# Altium schematic sheet Input Digital.SchDoc
size A3; SheetNumber: 6; SheetTotal: 8
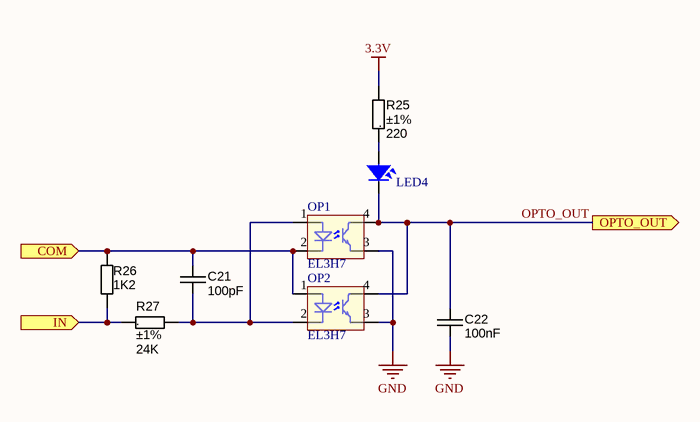
[diagram p0: Input Digital.SchDoc]

## Parts
C21  100pF  [CAPC1608X90N]
C22  100nF  [CAPC1608X90N]
LED4  LED  [LED-0805-Green]  (value not drawn)
OP1  EL3H7  [IC_SMD_SSOP4_NEW]
OP2  EL3H7  [IC_SMD_SSOP4_NEW]
R25  value 220  Tolerance: ±1%  [RESC1608X55N]  (hidden comment: 10K_0603_1%)
R26  value 1K2  [RES_2W_AXIAL_11x4_STAND]  (hidden comment: Metal Film)
R27  value 24K  Tolerance: ±1%  [RESC2012X70N]  (hidden comment: 24K_0805_1%)

## Ports
COM (in), IN (in), OPTO_OUT (out)

## Nets
3.3V: R25.2
GND: C22.2 OP1.3(E) OP2.3(E)
COM: C21.1 OP1.2(K) OP2.1(A) R26.1 ; port COM
IN: R26.2 R27.1 ; port IN
OPTO_OUT: C22.1 LED4.2 OP1.4(C) OP2.4(C) ; port OPTO_OUT
NetC21_2: C21.2 OP1.1(A) OP2.2(K) R27.2
NetLED4_1: LED4.1 R25.1

## Notes on the sheet
- Title
- Size:
- Date:
- A3
- Number:
- Time:
- Revision:
- Sheet
- of
- NICHIETSUVN.COM <http://NICHIETSUVN.COM>
- R&D
- File:
- (in symbol RES_10K_0603_1%) .
- (in symbol RES_24K_0805_1%) .

## Library data of the parts
C21 = CAPC_100pF_0603_C0G_NP0_100V_5%: 100pF ±5% 100V Ceramic Capacitor C0G, NP0 0603 (1608 Metric); Manufacturer 1: TDK Corporation; Pcs 2: 10; Tolerance: ±5%; Operating Temperature: -55°C ~ 125°C; Package / Case: 0603 (1608 Metric); Voltage - Rated: 100V; Temperature Coefficient: C0G, NP0; Ratings: AEC-Q200; Applications: Automotive; Packaging: Digi-Reel®; Supplier 1: Digi-Key; Supplier Part Number 1: 445-5724-6-ND; Value: 100pF; Supplier 2: https://www.thegioiic.com; Supplier Part Number 2: https://www.thegioiic.com/products/tu-gom-0603-100pf-50v; Price 2: 1800
C22 = CAPC_100nF_0603_X7R_50V_10%: 0.1µF ±10% 50V Ceramic Capacitor X7R 0603 (1608 Metric); Manufacturer 1: TDK Corporation; Manufacturer Part Number 1: CGA3E2X7R1H104K080AA; Pcs 2: 10; Supplier 1: Digi-Key; Supplier Part Number 1: 445-5666-6-ND; Tolerance: ±10%; Operating Temperature: -55°C ~ 125°C; Package / Case: 0603 (1608 Metric); Voltage - Rated: 50V; Ratings: AEC-Q200; Temperature Coefficient: X7R; Applications: Automotive; Packaging: Digi-Reel®; Supplier 2: www.thegioiic.com; Supplier Part Number 2: https://www.thegioiic.com/products/tu-gom-0603-100nf-0-1uf-50v; Price 2: 1800; Value: 100nF
LED4 = LED SMD: Value: LED 3 - 5 ly 2 Colour
OP1 OP2 = OPTO_EL3H7: Photo Transistor; Manufacturer Part Number 1: EL3H7(TA)-VG; Manufacturer 1: Everlight Electronics Co Ltd; Pcs 2: 1; Operating Temperature: -55°C ~ 110°C; Supplier 1: Digi-Key; Supplier Part Number 1: 1080-1198-6-ND; Supplier 2: linhkien.cxt.vn; Supplier Part Number 2: https://linhkien.cxt.vn/2637-el3h7bta-vg.html; Price 2: 1100
R25 = RES_10K_0603_1%: 10 kOhms ±1% 0.1W, 1/10W Chip Resistor 0603 (1608 Metric) Anti-Sulfur, Automotive AEC-Q200, Moisture Resistant Thin Film; Manufacturer: Stackpole Electronics Inc; Manufacturer Part Number: RMCF0603FT10K0; Temperature Coefficient: ±100ppm/°C; Pcs 2: 50; Package / Case: 0603 (1608 Metric); Power (Watts): 1/10W; Supplier 1: Digi-Key; Supplier Part Number 1: RMCF0603FT10K0DKR-ND; Ratings: Automotive AEC-Q200; Operating Temperature: -55°C ~ 155°C; Supplier 2: www.thegioiic.com; Supplier Part Number 2: https://www.thegioiic.com/products/dien-tro-10-kohm-0603-1; Price 2: 2000
R26 = RES_390R_Axial_2W_5%: Resistor THD 390 Ohm 2W 5% Metal Film; Manufacturer 1: Yageo; Manufacturer Part Number 1: FMP200JR-52-390R; Pcs 2: 1; Tolerance: ±5%; Size / Dimension: 0.154" Dia x 0.354" L (3.90mm x 9.00mm); Power (Watts): 2W; Supplier 2: https://www.thegioiic.com; Supplier Part Number 2: https://www.thegioiic.com/products/dien-tro-390-ohm-2w-5-4-vong-mau; Price 2: 500; Supplier 1: Digi-Key; Supplier Part Number 1: 390ZTR-ND
R27 = RES_24K_0805_1%: 24 kOhms ±1% 0.125W, 1/8W Chip Resistor 0805 (2012 Metric) Automotive AEC-Q200 Thick Film; Manufacturer: Stackpole Electronics Inc; Manufacturer Part Number: RMCF0805FT10K5; Power (Watts): 0.1W, 1/10W; Temperature Coefficient: ±100ppm/°C; Pcs 2: 50; Package / Case: 0805 (2012 Metric); Features: Automotive AEC-Q200; Supplier 1: Digi-Key; Supplier Part Number 1: RMCF0805FT24K0DKR-ND; Operating Temperature: -55°C ~ 155°C; Supplier 2: www.thegioiic.com; Supplier Part Number 2: https://www.thegioiic.com/products/dien-tro-24-kohm-0805-5; Price 2: 1800